# EAGLE board MSP-EXP430F5529_2_2 (EAGLE 6.5.0), part 1 of 2
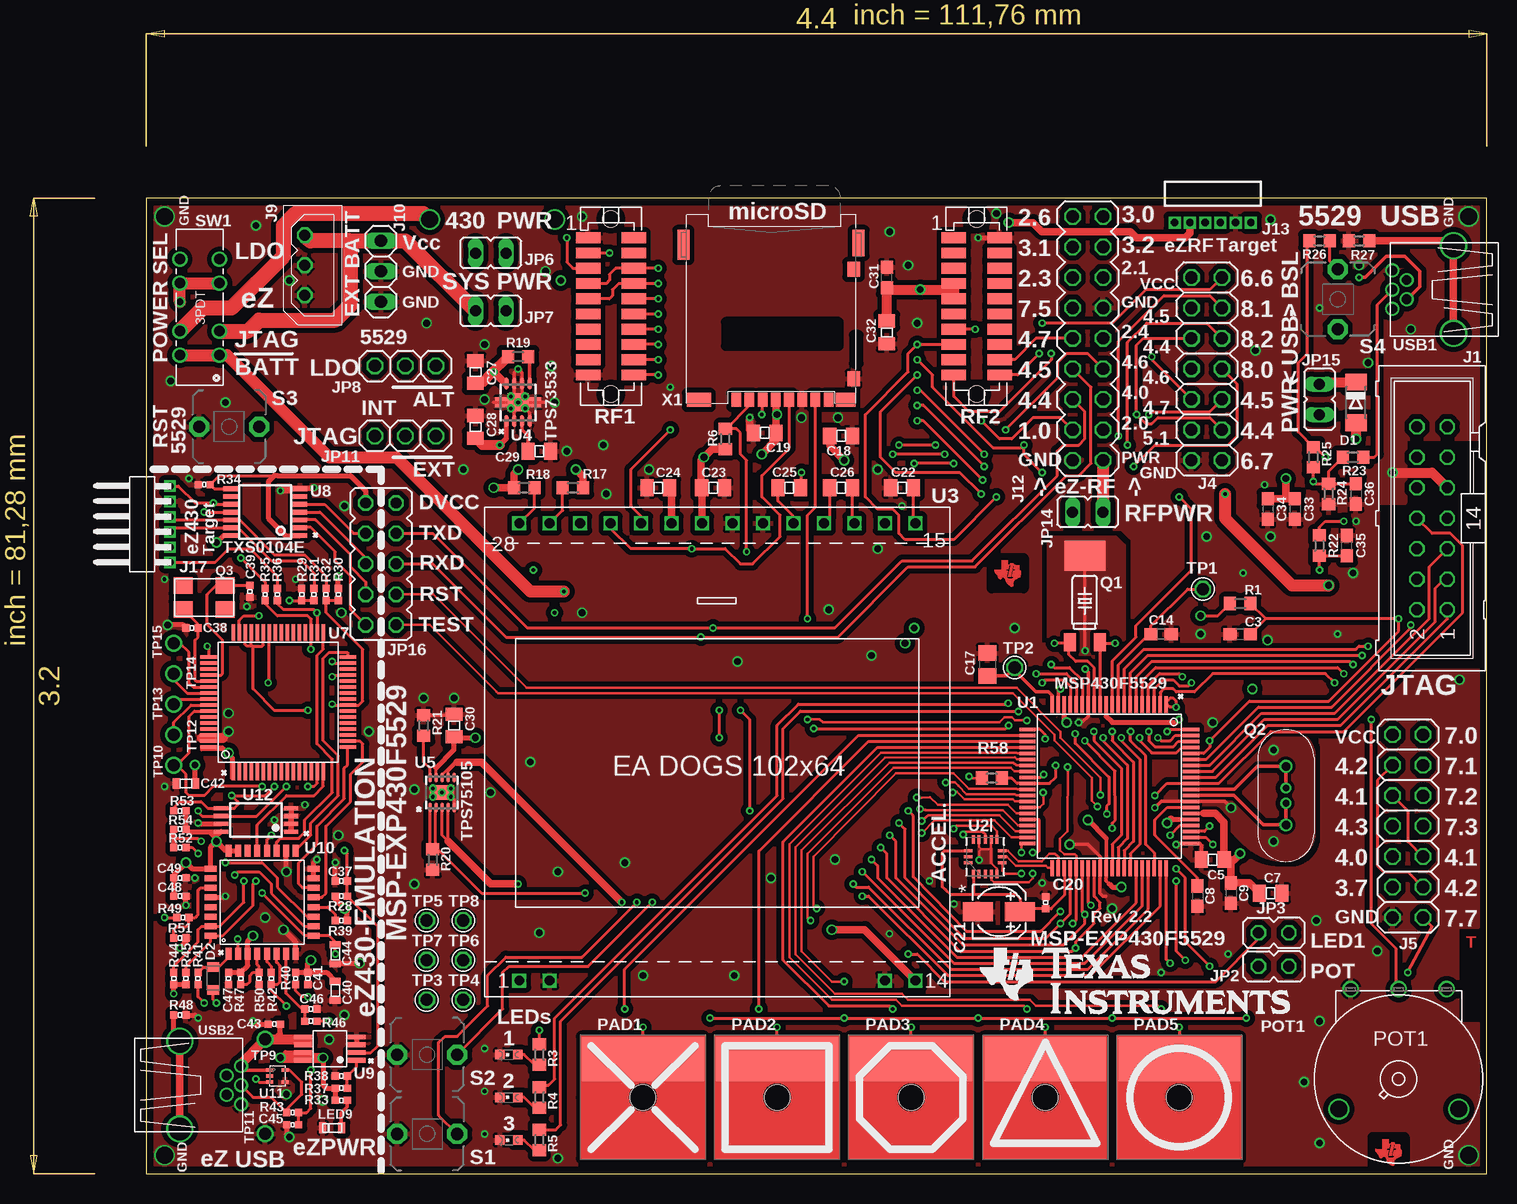
[diagram p8: board, top side]
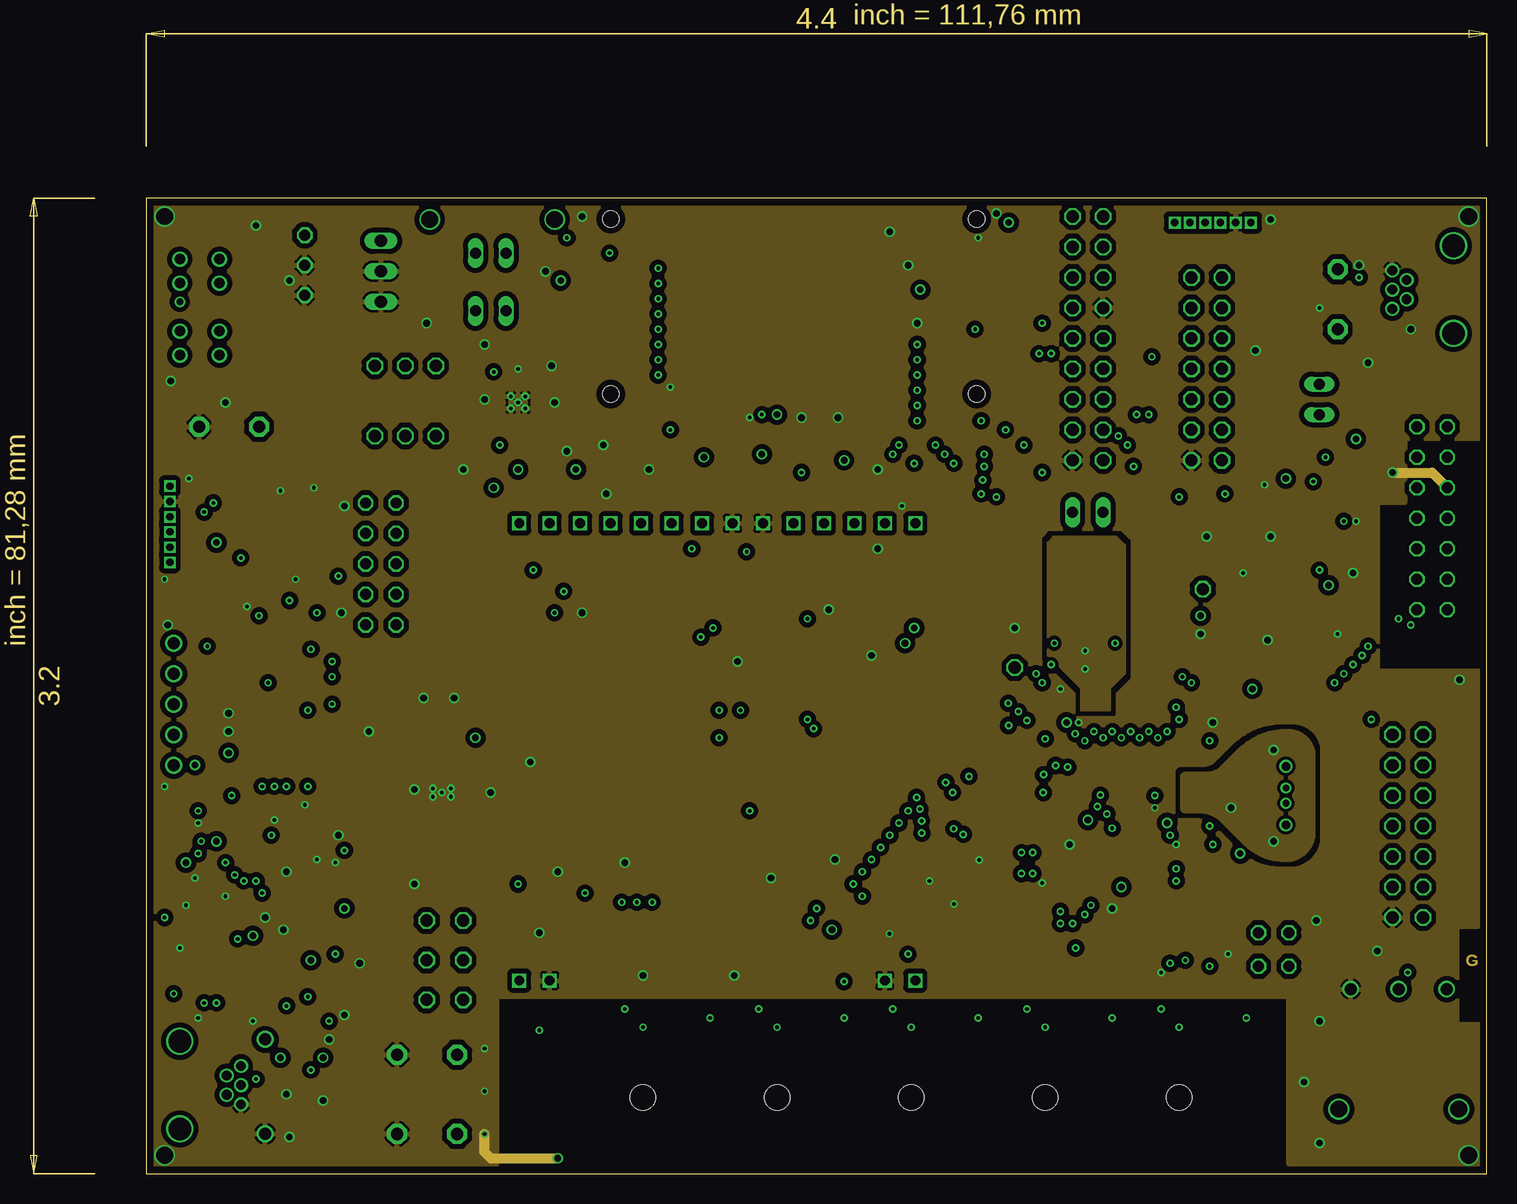
[diagram p9: board, inner layer GND]
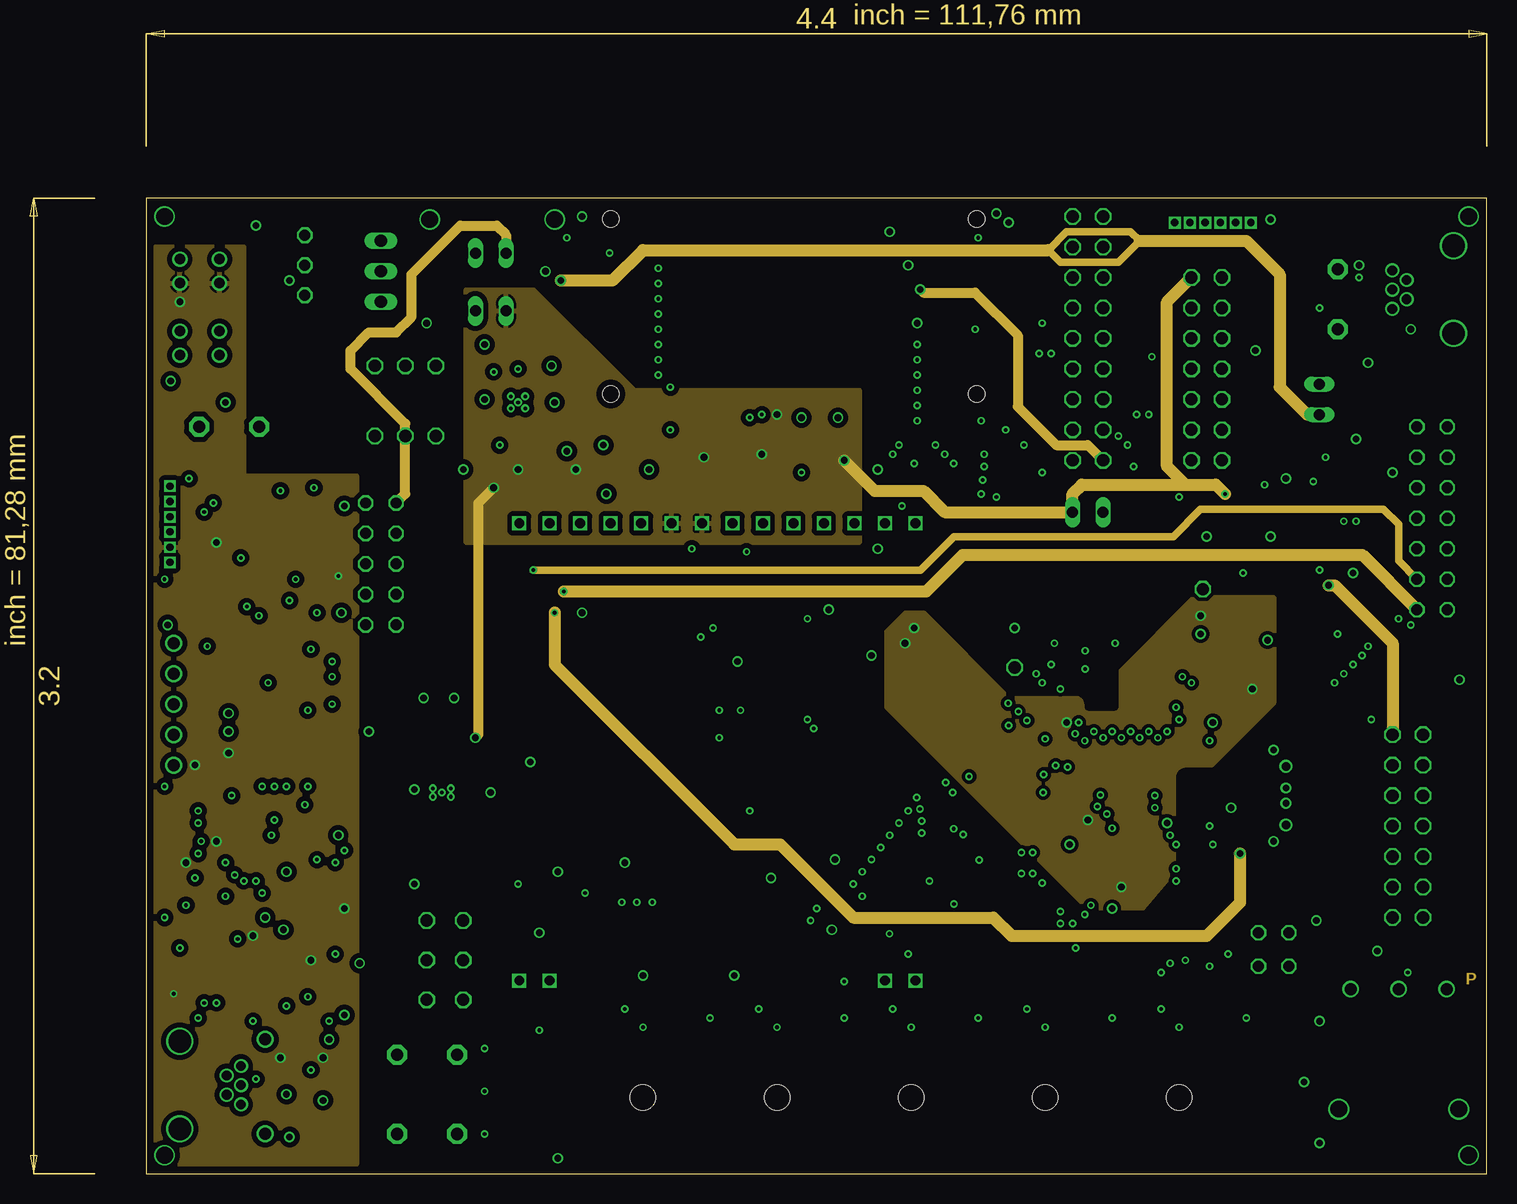
[diagram p10: board, inner layer PWR]
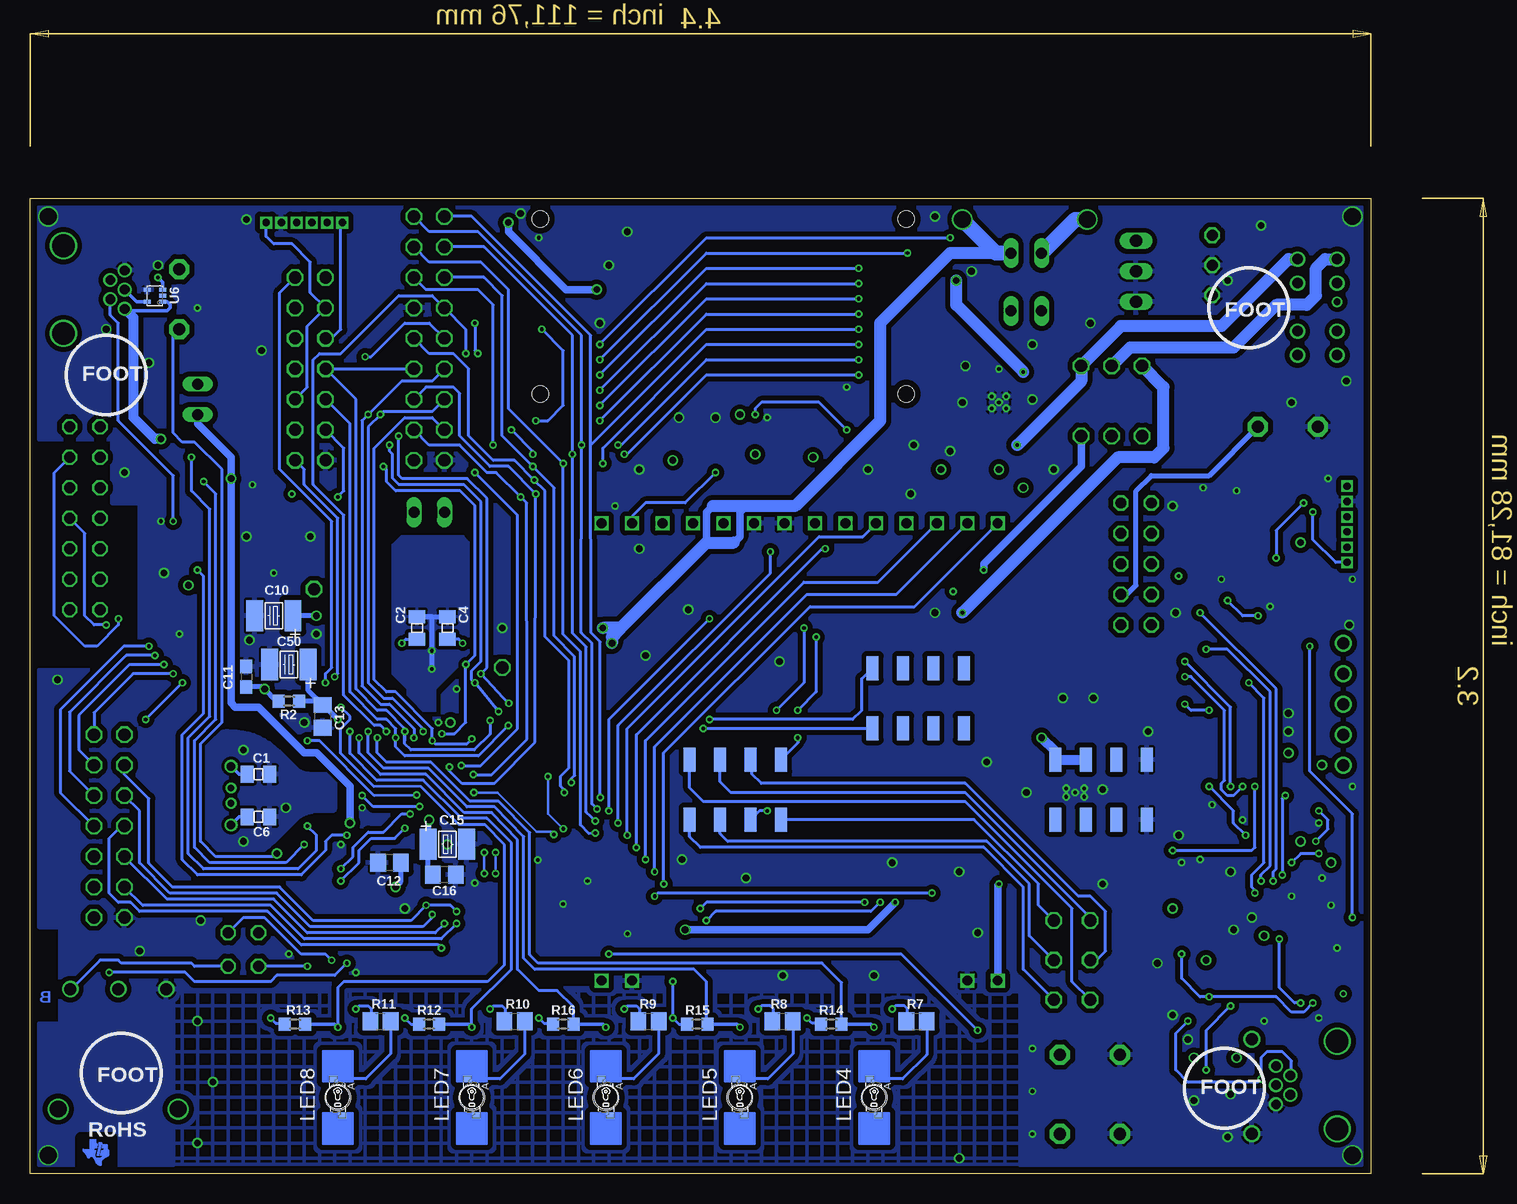
[diagram p11: board, bottom side, seen from below]

Size 111.76 x 81.28 mm. Coordinates in mm from the lower left corner, seen from the top.
Outline: 0,0 111.76,0 111.76,81.28 0,81.28 0,0
Copper layers (1+2*15+16): Top 0.0178mm / dielectric 12mil / GND 0.0356mm / dielectric 27mil / PWR 0.0356mm / dielectric 12mil / Bottom 0.0178mm
Design rules "default": minimum track width 6mil, minimum drill 12mil, track to track 6mil, track to pad 6mil, pad to pad 6mil, via to via 6mil, smd to smd 6mil, copper to edge 20mil, drill to drill 8mil, minimum pad ring 7mil, minimum via ring 6mil, stop-mask expansion 0mil, vias tented up to drill 25mil, thermal gap 8mil
Net classes: 0 Default: width 0.254 mm, drill 0.305 mm, clearance 0.152 mm; 1 Ground: width 0.305 mm, drill 0.305 mm, clearance 0.152 mm to class 0, clearance 0.152 mm; 2 Power: width 0.406 mm, drill 0.305 mm, clearance 0.152 mm to class 0, clearance 0.152 mm to class 1, clearance 0.152 mm

## Footprints (pad centres in the part's own frame; a part is rotated, then mirrored left to right if it is on the bottom)
CSMD0805 = smd 1.092 x 1.397: 1 -0.94,0; 2 0.94,0
C0603 = smd 1.1 x 1: 1 -0.85,0; 2 0.85,0
1210ELKO = smd 1.397 x 2.591: + 1.6,0; - -1.6,0
C0805 = smd 1.3 x 1.5: 1 -0.95,0; 2 0.95,0
0402 = smd 0.6 x 0.6: 1 -0.501,0; 2 0.501,0
ELKO_B = smd 2.5 x 1.6: + 1.746,0; - -1.746,0
0603 = smd 0.6 x 0.9: 1 -0.787,0; 2 0.787,0
8PIN_SM_MA_HEADER = smd 1 x 2: 1 -3.81,-2.5; 2 -3.81,2.5; 3 -1.27,-2.5; 4 -1.27,2.5; 5 1.27,-2.5; 6 1.27,2.5; 7 3.81,-2.5; 8 3.81,2.5
MINIMELF = smd 1.4 x 1.8: A 1.7,0; C -1.7,0
SOD110-R = smd 0.8 x 1: A 0.95,0; C -0.95,0
ML14 = drill 0.914 octagon: 1 -7.62,-1.27; 2 -7.62,1.27; 3 -5.08,-1.27; 4 -5.08,1.27; 5 -2.54,-1.27; 6 -2.54,1.27; 7 0,-1.27; 8 0,1.27; 9 2.54,-1.27; 10 2.54,1.27; 11 5.08,-1.27; 12 5.08,1.27; 13 7.62,-1.27; 14 7.62,1.27
2X07 = drill 1.016 octagon: 1 -7.62,-1.27; 2 -7.62,1.27; 3 -5.08,-1.27; 4 -5.08,1.27; 5 -2.54,-1.27; 6 -2.54,1.27; 7 0,-1.27; 8 0,1.27; 9 2.54,-1.27; 10 2.54,1.27; 11 5.08,-1.27; 12 5.08,1.27; 13 7.62,-1.27; 14 7.62,1.27
MOLEX-3P-HEADER = drill 0.9 pad 1.3 octagon: 1 2.5,0; 2 0,0; 3 -2.5,0
1X03 = drill 1.016 long: 1 -2.54,0; 2 0,0; 3 2.54,0
_MSP430_RF_MA09-2 = drill 1.016 octagon: 1 -10.16,1.27; 2 -10.16,-1.27; 3 -7.62,1.27; 4 -7.62,-1.27; 5 -5.08,1.27; 6 -5.08,-1.27; 7 -2.54,1.27; 8 -2.54,-1.27; 9 0,1.27; 10 0,-1.27; 11 2.54,1.27; 12 2.54,-1.27; 13 5.08,1.27; 14 5.08,-1.27; 15 7.62,1.27; 16 7.62,-1.27; 17 10.16,1.27; 18 10.16,-1.27
SL127L6 = drill 0.6 pad 1 square: 1 -3.175,0; 2 -1.905,0; 3 -0.635,0; 4 0.635,0; 5 1.905,0; 6 3.175,0
SL127L6_MPE = drill 0.6 pad 0.889 square: 1 -3.17,0.07; 2 -1.91,0.07; 3 -0.63,0.07; 4 0.63,0.07; 5 1.91,0.07; 6 3.18,0.07
JP1S = drill 0.914 octagon: 1 -1.27,0; 2 1.27,0
JP1 = drill 0.914 long: 1 0,-1.27; 2 0,1.27
1X03S = drill 1.016 octagon: 1 -2.54,0; 2 0,0; 3 2.54,0
JP5Q = drill 0.914 octagon: 1 -5.08,-1.27; 2 -5.08,1.27; 3 -2.54,-1.27; 4 -2.54,1.27; 5 0,-1.27; 6 0,1.27; 7 2.54,-1.27; 8 2.54,1.27; 9 5.08,-1.27; 10 5.08,1.27
CHIPLED_0603 = smd 0.8 x 0.8: A 0,-0.75; C 0,0.75
LB_P4SG_Q65110A8252 = smd 0.508 x 0.711: A 1.549,0.368; C -1.549,-0.368 | hole 2.108: 0,0
DIODE0603 = smd 0.6 x 0.9: A -0.787,0; K 0.787,0
PAD_10X10_LB_P4SG = smd 10.16 x 3.683: 1 0,3.175
TW-700171 = drill 1: 1 -4,-7.5; 2 0,-7.5; 3 4,-7.5 | drill 1.4: 4 5,2.5; 5 -5,2.5
F20XX_PIR_DEMO_&_EVAL_CMJ206T = smd 1 x 1.5: P1 -1.25,-5; P2 1.25,-5 | smd 3.4 x 2.5: P3 0,2.2
QUARZ_HC49_4P = drill 0.7: 1 2.44,0; 2 -2.44,0 | drill 0.55: 1.1 0.635,0; 2.1 -0.635,0
FT10A = smd 1.6 x 1.35: P$1 -1.75,-1; P$2 1.75,-1; P$3 1.75,1; P$4 -1.75,1
R0603 = smd 1 x 1.1: 1 -0.85,0; 2 0.85,0
R0805 = smd 1.3 x 1.5: 1 -0.85,0; 2 0.85,0
TFM-110-02-SM-D-A-K = smd 2.032 x 0.889: 1 -1.27,5.08; 2 2.54,5.08; 3 -1.27,3.81; 4 2.54,3.81; 5 -1.27,2.54; 6 2.54,2.54; 7 -1.27,1.27; 8 2.54,1.27; 9 -1.27,0; 10 2.54,0; 11 -1.27,-1.27; 12 2.54,-1.27; 13 -1.27,-2.54; 14 2.54,-2.54; 15 -1.27,-3.81; 16 2.54,-3.81; 17 -1.27,-5.08; 18 2.54,-5.08; 19 -1.27,-6.35; 20 2.54,-6.35 | hole 1.359: 0.635,6.668; 0.635,-7.938
PBTH = drill 1.016 pad 1.676 octagon: 1 -0.001,0.001; 2 5.001,0.001
3PDT = drill 0.889 pad 1.27: 1 0,0; 2 2,0; 3 6,0; 4 8,0; 5 0,-3.3; 6 2,-3.3; 7 6,-3.3; 8 8,-3.3
TP = drill 1.016 octagon: 1 0,0
TP10 = drill 1 pad 1.422: 1 0,0
PN80 = smd 1.35 x 0.3: 1 -6.825,4.75; 2 -6.825,4.25; 3 -6.825,3.75; 4 -6.825,3.25; 5 -6.825,2.75; 6 -6.825,2.25; 7 -6.825,1.75; 8 -6.825,1.25; 9 -6.825,0.75; 10 -6.825,0.25; 11 -6.825,-0.25; 12 -6.825,-0.75; 13 -6.825,-1.25; 14 -6.825,-1.75; 15 -6.825,-2.25; 16 -6.825,-2.75; 17 -6.825,-3.25; 18 -6.825,-3.75; 19 -6.825,-4.25; 20 -6.825,-4.75; 41 6.825,-4.75; 42 6.825,-4.25; 43 6.825,-3.75; 44 6.825,-3.25; 45 6.825,-2.75; 46 6.825,-2.25; 47 6.825,-1.75; 48 6.825,-1.25; 49 6.825,-0.75; 50 6.825,-0.25; 51 6.825,0.25; 52 6.825,0.75; 53 6.825,1.25; 54 6.825,1.75; 55 6.825,2.25; 56 6.825,2.75; 57 6.825,3.25; 58 6.825,3.75; 59 6.825,4.25; 60 6.825,4.75 | smd 0.3 x 1.35: 21 -4.75,-6.825; 22 -4.25,-6.825; 23 -3.75,-6.825; 24 -3.25,-6.825; 25 -2.75,-6.825; 26 -2.25,-6.825; 27 -1.75,-6.825; 28 -1.25,-6.825; 29 -0.75,-6.825; 30 -0.25,-6.825; 31 0.25,-6.825; 32 0.75,-6.825; 33 1.25,-6.825; 34 1.75,-6.825; 35 2.25,-6.825; 36 2.75,-6.825; 37 3.25,-6.825; 38 3.75,-6.825; 39 4.25,-6.825; 40 4.75,-6.825; 61 4.75,6.825; 62 4.25,6.825; 63 3.75,6.825; 64 3.25,6.825; 65 2.75,6.825; 66 2.25,6.825; 67 1.75,6.825; 68 1.25,6.825; 69 0.75,6.825; 70 0.25,6.825; 71 -0.25,6.825; 72 -0.75,6.825; 73 -1.25,6.825; 74 -1.75,6.825; 75 -2.25,6.825; 76 -2.75,6.825; 77 -3.25,6.825; 78 -3.75,6.825; 79 -4.25,6.825; 80 -4.75,6.825
LGA16R50P3X5_300X300X100 = smd 0.711 x 0.254: 1 -1.422,0.991; 2 -1.422,0.508; 3 -1.422,0; 4 -1.422,-0.508; 5 -1.422,-0.991; 9 1.422,-0.991; 10 1.422,-0.508; 11 1.422,0; 12 1.422,0.508; 13 1.422,0.991 | smd 0.254 x 0.711: 6 -0.508,-1.422; 7 0,-1.422; 8 0.508,-1.422; 14 0.508,1.422; 15 0,1.422; 16 -0.508,1.422
EADOGS102-6 = drill 0.813 square: 1 2.89,1.35; 2 5.43,1.35; 13 33.37,1.35; 14 35.91,1.35; 15 35.91,39.45; 16 33.37,39.45; 17 30.83,39.45; 18 28.29,39.45; 19 25.75,39.45; 20 23.21,39.45; 21 20.67,39.45; 22 18.13,39.45; 23 15.59,39.45; 24 13.05,39.45; 25 10.51,39.45; 26 7.97,39.45; 27 5.43,39.45; 28 2.89,39.45
DRB_S-PVSON-N8 = smd 0.35 x 1.025: 1 -0.975,-1.562; 2 -0.325,-1.562; 3 0.325,-1.562; 4 0.975,-1.562; 5 0.975,1.562; 6 0.325,1.562; 7 -0.325,1.562; 8 -0.975,1.562 | drill 0.305: PP@1 0,0; PP@2 -0.6,-0.5; PP@3 0.6,-0.5; PP@4 0.6,0.5; PP@5 -0.6,0.5 | smd 1.75 x 1.5: TH 0,0 | smd 3.8 x 0.28: TH@1 0,0.275; TH@2 0,-0.275
DSK_S-PDSO-N10 = smd 0.28 x 0.8: 1 -1,-1.25; 2 -0.5,-1.25; 3 0,-1.25; 4 0.5,-1.25; 5 1,-1.25; 6 1,1.25; 7 0.5,1.25; 8 0,1.25; 9 -0.5,1.25; 10 -1,1.25 | drill 0.3: P$1 0,0; P$2 0.75,0.35; P$3 0.75,-0.35; P$4 -0.75,-0.35; P$5 -0.75,0.35 | smd 2 x 1.2: PP 0,0
TPD2E001-DRL = smd 0.3 x 0.6: 1 -0.5,-0.65; 2 0,-0.65; 3 0.5,-0.65; 4 0.5,0.65; 5 -0.5,0.65
PM/PAG64 = smd 1.4 x 0.3: 1 -5.88,3.67; 2 -5.88,3.17; 3 -5.88,2.67; 4 -5.88,2.17; 5 -5.88,1.67; 6 -5.88,1.17; 7 -5.88,0.67; 8 -5.88,0.17; 9 -5.88,-0.33; 10 -5.88,-0.83; 11 -5.88,-1.33; 12 -5.88,-1.83; 13 -5.88,-2.33; 14 -5.88,-2.83; 15 -5.88,-3.33; 16 -5.88,-3.83; 33 5.72,-3.83; 34 5.72,-3.33; 35 5.72,-2.83; 36 5.72,-2.33; 37 5.72,-1.83; 38 5.72,-1.33; 39 5.72,-0.83; 40 5.72,-0.33; 41 5.72,0.17; 42 5.72,0.67; 43 5.72,1.17; 44 5.72,1.67; 45 5.72,2.17; 46 5.72,2.67; 47 5.72,3.17; 48 5.72,3.67 | smd 0.3 x 1.4: 17 -3.83,-5.88; 18 -3.33,-5.88; 19 -2.83,-5.88; 20 -2.33,-5.88; 21 -1.83,-5.88; 22 -1.33,-5.88; 23 -0.83,-5.88; 24 -0.33,-5.88; 25 0.17,-5.88; 26 0.67,-5.88; 27 1.17,-5.88; 28 1.67,-5.88; 29 2.17,-5.88; 30 2.67,-5.88; 31 3.17,-5.88; 32 3.67,-5.88; 49 3.67,5.72; 50 3.17,5.72; 51 2.67,5.72; 52 2.17,5.72; 53 1.67,5.72; 54 1.17,5.72; 55 0.67,5.72; 56 0.17,5.72; 57 -0.33,5.72; 58 -0.83,5.72; 59 -1.33,5.72; 60 -1.83,5.72; 61 -2.33,5.72; 62 -2.83,5.72; 63 -3.33,5.72; 64 -3.83,5.72
PW_R-PDSO-G14 = smd 0.4 x 1.2: 1 -1.95,-2.9; 2 -1.3,-2.9; 3 -0.65,-2.9; 4 0,-2.9; 5 0.65,-2.9; 6 1.3,-2.9; 7 1.95,-2.9; 8 1.95,2.9; 9 1.3,2.9; 10 0.65,2.9; 11 0,2.9; 12 -0.65,2.9; 13 -1.3,2.9; 14 -1.95,2.9
MSOP8 = smd 0.4 x 1.5: 1 -0.978,-2.3; 2 -0.333,-2.3; 3 0.323,-2.3; 4 0.968,-2.3; 5 0.968,2.18; 6 0.323,2.18; 7 -0.333,2.18; 8 -0.978,2.18
QFP32 = smd 0.5 x 1: 1 -2.8,-4.3; 2 -2,-4.3; 3 -1.2,-4.3; 4 -0.4,-4.3; 5 0.4,-4.3; 6 1.2,-4.3; 7 2,-4.3; 8 2.8,-4.3; 17 2.8,4.3; 18 2,4.3; 19 1.2,4.3; 20 0.4,4.3; 21 -0.4,4.3; 22 -1.2,4.3; 23 -2,4.3; 24 -2.8,4.3 | smd 1 x 0.5: 9 4.3,-2.8; 10 4.3,-2; 11 4.3,-1.2; 12 4.3,-0.4; 13 4.3,0.4; 14 4.3,1.2; 15 4.3,2; 16 4.3,2.8; 25 -4.3,2.8; 26 -4.3,2; 27 -4.3,1.2; 28 -4.3,0.4; 29 -4.3,-0.4; 30 -4.3,-1.2; 31 -4.3,-2; 32 -4.3,-2.8
USBFET_TSSOP8 = smd 1.2 x 0.35: 1 -2.925,0.975; 2 -2.925,0.325; 3 -2.925,-0.325; 4 -2.925,-0.975; 5 2.925,-0.975; 6 2.925,-0.325; 7 2.925,0.325; 8 2.925,0.975
USB-MB-H = drill 0.8: D+ 5.1,0; D- 3.9,0.8; GND 5.1,-1.6; ID 3.9,-0.8; VBUS 5.1,1.6 | drill 1.9: GND@1 0,3.65; GND@2 0,-3.65
SD-502702-003 = smd 0.8 x 1.16: 1 -2.9,-17.82; 2 -1.8,-17.82; 3 -0.7,-17.82; 4 0.4,-17.82; 5 1.5,-17.82; 6 2.6,-17.82; 7 3.7,-17.82; 8 4.8,-17.82 | smd 1.05 x 1.25: A 6.885,-16.075; B 6.885,-6.95 | smd 1 x 2.5: P$9 -7.3,-4.9 | smd 1 x 2.2: P$10 7.3,-4.75 | smd 2 x 1.16: P$11 -6.01,-17.82 | smd 1.6 x 1.16: P$12 6.24,-17.82

## Placement (x,y rotation side)
C1  47pF  [CSMD0805]  92.71,33.27 0 bottom
C2  12pF  [CSMD0805]  79.5,45.47 90 bottom
C3  DNP  [C0603]  91.19,44.96 0 top
C4  12pF  [CSMD0805]  76.96,45.47 90 bottom
C5  10µF  [CSMD0805]  88.9,26.16 180 top
C6  47pF  [CSMD0805]  92.71,29.72 0 bottom
C7  100nF  [CSMD0805]  93.73,23.37 0 top
C8  220n  [C0603]  87.63,23.11 270 top
C9  220n  [C0603]  90.42,23.37 270 top
C10  10uF/6,3V  [1210ELKO]  91.44,46.48 0 bottom
C11  100n  [C0603]  93.73,41.4 270 bottom
C12  100n  [C0805]  81.79,25.91 180 bottom
C13  100n  [C0805]  87.38,38.1 270 bottom
C14  DNP  [C0603]  84.58,44.96 180 top
C15  10uF/6,3V  [1210ELKO]  76.96,27.43 180 bottom
C16  100n  [C0805]  77.22,24.89 180 bottom
C17  470n  [C0805]  70.1,42.42 270 top
C18  10µF  [CSMD0805]  57.91,61.47 180 top
C19  100nF  [CSMD0805]  51.56,61.72 0 top
C20  100n  [0402]  74.96,22.57 270 top
C21  10UF  [ELKO_B]  71.09,21.83 0 top
C22  1µF  [CSMD0805]  62.99,57.15 180 top
C23  1µF  [CSMD0805]  47.24,57.15 180 top
C24  1µF  [CSMD0805]  42.67,57.15 0 top
C25  1µF  [CSMD0805]  53.59,57.15 180 top
C26  1µF  [CSMD0805]  57.91,57.15 180 top
C27  1µF  [CSMD0805]  27.43,66.8 270 top
C28  4.7uF  [CSMD0805]  27.43,62.23 270 top
C29  10nF  [CSMD0805]  32.77,60.2 180 top
C30  1µF  [CSMD0805]  25.65,37.34 270 top
C31  .1u  [C0603]  61.72,74.68 90 top
C32  4.7u  [CSMD0805]  61.72,70.1 270 top
C33  0.1u  [C0603]  95.76,55.37 270 top
C34  4u7  [C0603]  93.47,55.37 270 top
C35  10p  [C0603]  100.08,52.32 90 top
C36  10p  [C0603]  100.84,56.64 270 top
C37  10n  [0402]  16.26,24.38 180 top
C38  33p  [0402]  3.81,45.47 180 top
C39  33p  [0402]  8.64,48.51 270 top
C40  1u/6.3V  [0603]  15.75,15.24 90 top
C41  100n  [0402]  13.46,16.26 270 top
C42  1u/6.3V  [0603]  3.3,32.51 180 top
C43  100n  [0402]  10.67,12.45 0 top
C44  1u/6.3V  [0603]  15.75,18.29 270 top
C45  22p  [0402]  12.19,4.06 0 top
C46  22p  [0402]  13.72,13.72 180 top
C47  100n  [0402]  6.86,16.26 90 top
C48  100n  [0402]  2.79,23.11 180 top
C49  100n  [0402]  2.79,24.64 0 top
C50  10uF/6,3V  [1210ELKO]  90.17,42.42 0 bottom
CON1  8PIN_SM_MA_HEADER  [8PIN_SM_MA_HEADER]  52.96,32 0 bottom
CON2  8PIN_SM_MA_HEADER  [8PIN_SM_MA_HEADER]  22.48,32 0 bottom
CON3  8PIN_SM_MA_HEADER  [8PIN_SM_MA_HEADER]  37.72,39.62 0 bottom
D1  SCHOTTKY  [MINIMELF]  100.84,64.26 270 top
D2  1N4148  [SOD110-R]  5.59,16.26 90 top
J1  [ML14]  107.19,54.61 90 top
J4  [2X07]  88.39,67.06 270 top
J5  [2X07]  105.16,28.96 270 top
J9  MOLEX3PIN  [MOLEX-3P-HEADER]  13.21,75.69 90 top
J10  PWR  [1X03]  19.56,75.18 90 top
J12  eZ-RF1  [_MSP430_RF_MA09-2]  78.49,69.6 90 top
J13  eZRF  [SL127L6]  88.9,79.25 0 top
J17  SL127L6TH  [SL127L6_MPE]  2.03,54.1 90 top
JP2  POT_JMP  [JP1S]  93.98,17.27 180 top
JP3  LED_JMP  [JP1S]  93.98,20.07 180 top
JP6  430_PWR  [JP1]  28.7,76.71 270 top
JP7  SYS_PWR  [JP1]  28.7,71.88 270 top
JP8  LDO_PWR_SEL  [1X03S]  21.59,67.31 0 top
JP11  JTAG_PWR_SEN  [1X03S]  21.59,61.47 180 top
JP14  RF_PWR  [JP1]  78.49,55.12 270 top
JP15  USB_PWR  [JP1]  97.79,64.52 0 top
JP16  eZ430-FET_JMP  [JP5Q]  19.56,50.8 90 top
LED1  [CHIPLED_0603]  30.23,9.91 90 top
LED2  [CHIPLED_0603]  30.23,6.35 90 top
LED3  [CHIPLED_0603]  30.23,2.79 90 top
LED4  LB_P4SG_Q65110A8252LB  [LB_P4SG_Q65110A8252]  41.4,6.35 90 bottom
LED5  LB_P4SG_Q65110A8252LB  [LB_P4SG_Q65110A8252]  52.58,6.35 90 bottom
LED6  LB_P4SG_Q65110A8252LB  [LB_P4SG_Q65110A8252]  63.75,6.35 90 bottom
LED7  LB_P4SG_Q65110A8252LB  [LB_P4SG_Q65110A8252]  74.93,6.35 90 bottom
LED8  LB_P4SG_Q65110A8252LB  [LB_P4SG_Q65110A8252]  86.11,6.35 90 bottom
LED9  green  [DIODE0603]  15.49,3.81 180 top
PAD1  TPAD_TOPLB_P4SG  [PAD_10X10_LB_P4SG]  41.4,6.35 0 top
PAD2  TPAD_TOPLB_P4SG  [PAD_10X10_LB_P4SG]  52.58,6.35 0 top
PAD3  TPAD_TOPLB_P4SG  [PAD_10X10_LB_P4SG]  63.75,6.35 0 top
PAD4  TPAD_TOPLB_P4SG  [PAD_10X10_LB_P4SG]  74.93,6.35 0 top
PAD5  TPAD_TOPLB_P4SG  [PAD_10X10_LB_P4SG]  86.11,6.35 0 top
POT1  RV100F-30-4K1-B54  [TW-700171]  104.39,7.87 180 top
Q1  32.768kHz  [F20XX_PIR_DEMO_&_EVAL_CMJ206T]  78.23,49.28 0 top
Q2  QUARZ_HC49_4P-1  [QUARZ_HC49_4P]  95,31.5 270 top
Q3  12MHz  [FT10A]  4.83,48.01 0 top
R1  47k  [R0603]  91.19,47.5 180 top
R2  0R  [R0603]  90.17,39.37 180 bottom
R3  470R  [R0603]  32.77,9.91 270 top
R4  470R  [R0603]  32.77,6.35 270 top
R5  470R  [R0603]  32.77,2.79 270 top
R6  47k  [R0603]  48.26,61.21 90 top
R7  680  [R0805]  37.85,12.7 0 bottom
R8  680  [R0805]  49.02,12.7 0 bottom
R9  680  [R0805]  60.2,12.7 0 bottom
R10  680  [R0805]  71.37,12.7 0 bottom
R11  680  [R0805]  82.55,12.7 0 bottom
R12  100K  [R0603]  78.49,12.45 0 bottom
R13  100k  [R0603]  89.66,12.45 0 bottom
R14  100k  [R0603]  44.96,12.45 0 bottom
R15  100K  [R0603]  56.13,12.45 0 bottom
R16  100k  [R0603]  67.31,12.45 180 bottom
R17  47k  [R0603]  35.56,57.15 180 top
R18  47k  [R0603]  31.5,57.15 0 top
R19  0  [R0603]  30.99,68.07 180 top
R20  100k  [R0603]  23.88,26.16 90 top
R21  36k 1%  [R0603]  23.11,37.34 270 top
R22  27R  [R0603]  97.79,52.32 90 top
R23  27R  [R0603]  100.58,59.69 0 top
R24  1M  [R0603]  98.55,56.64 90 top
R25  1k4  [R0603]  97.28,59.69 270 top
R26  100R  [R0603]  97.79,77.72 0 top
R27  33k  [R0603]  101.09,77.72 0 top
R28  47k  [0402]  16.26,23.11 180 top
R29  47k  [0402]  12.95,48.26 90 top
R30  47k  [0402]  16,48.26 90 top
R31  100R  [0402]  13.97,48.26 90 top
R32  100R  [0402]  14.99,48.26 90 top
R33  270  [0402]  16.26,6.1 180 top
R34  DNP  [0402]  4.83,57.4 0 top
R35  100R  [0402]  9.91,48.26 90 top
R36  100R  [0402]  10.92,48.26 90 top
R37  6k8  [0402]  16.26,7.11 180 top
R38  3k3  [0402]  16.26,8.13 0 top
R39  10k  [0402]  16.26,21.08 0 top
R40  15k  [0402]  12.45,16.26 90 top
R41  33k  [0402]  4.32,16.26 270 top
R42  1k5  [0402]  10.41,16.26 90 top
R43  33R  [0402]  12.19,5.08 0 top
R44  47k  [0402]  2.29,16.26 270 top
R45  47k  [0402]  3.3,16.26 270 top
R46  33R  [0402]  13.72,12.7 180 top
R47  100k/1%  [0402]  7.87,16.26 90 top
R48  33k  [0402]  2.79,13.21 180 top
R49  3k3  [0402]  3.05,21.34 180 top
R50  100k/1%  [0402]  9.4,16.26 90 top
R51  3k3  [0402]  2.79,19.63 0 top
R52  100R  [0402]  2.79,27.18 0 top
R53  1k5  [0402]  2.79,30.23 180 top
R54  1k5  [0402]  2.79,28.7 180 top
R58  0R  [R0603]  70.49,32.96 180 top
RF1  [TFM-110-02-SM-D-A-K]  38.1,72.9 0 top
RF2  [TFM-110-02-SM-D-A-K]  68.58,72.9 0 top
S1  [PBTH]  25.91,3.3 180 top
S2  [PBTH]  25.91,9.91 180 top
S3  F5529_RST  [PBTH]  9.4,62.23 180 top
S4  USB_BSL  [PBTH]  99.31,70.36 90 top
SW1  [3PDT]  6.1,76.2 270 top
TP1  [TP]  88.07,48.7 180 top
TP2  [TP]  72.39,42.16 0 top
TP3  [TP]  23.37,14.48 0 top
TP4  [TP]  26.42,14.48 0 top
TP5  [TP]  23.37,21.08 0 top
TP6  [TP]  26.42,17.78 0 top
TP7  [TP]  23.37,17.78 0 top
TP8  [TP]  26.42,21.08 0 top
TP9  TP05TP10  [TP10]  9.91,11.18 90 top
TP10  TP05TP10  [TP10]  2.29,34.04 90 top
TP11  TP05TP10  [TP10]  9.91,3.3 90 top
TP12  TP05TP10  [TP10]  2.29,36.58 90 top
TP13  TP05TP10  [TP10]  2.29,39.12 90 top
TP14  TP05TP10  [TP10]  2.29,41.66 90 top
TP15  TP05TP10  [TP10]  2.29,44.2 90 top
U1  MSP430F5529IPNR  [PN80]  80.26,32.26 270 top
U2  LIS3DH  [LGA16R50P3X5_300X300X100]  69.93,26.4 90 top
U3  EA DOGS102-6 (LCD Display)  [EADOGS102-6]  28.19,14.73 0 top
U4  TPS73533  [DRB_S-PVSON-N8]  30.99,64.26 0 top
U5  TPS75105DSKR  [DSK_S-PDSO-N10]  24.64,31.75 0 top
U6  TPD2E001DRLR  [TPD2E001-DRL]  101.35,73.15 90 bottom
U7  MSP430F1612IPMR  [PM/PAG64]  10.92,39.37 90 top
U8  TXS0104EPWR  [PW_R-PDSO-G14]  9.91,55.12 90 top
U9  TPS77301DGK  [MSOP8]  15.24,10.41 90 top
U10  TUSB3410VF  [QFP32]  9.65,22.61 0 top
U11  TPD2E001DRLR  [TPD2E001-DRL]  10.92,8.13 270 top
U12  CAT24C128YI  [USBFET_TSSOP8]  9.14,29.46 180 top
U$1  [MSP430_LAB_TILOGO_SMALL]  71.88,50.29 0 top
U$2  [LOGO2008_TPLACE]  79.52,15.66 0 top
U$3  [MSP430_LAB_TILOGO_SMALL]  103.63,2.03 0 top
U$4  [MSP430_LAB_TILOGO_SMALL]  106.17,2.03 0 bottom
USB1  F5529 Mini-USB  [USB-MB-H]  108.97,73.66 180 top
USB2  eZ430-FET Mini-USB  [USB-MB-H]  2.79,7.37 0 top
X1  SD-502702-003-1  [SD-502702-003]  52.07,82.3 0 top